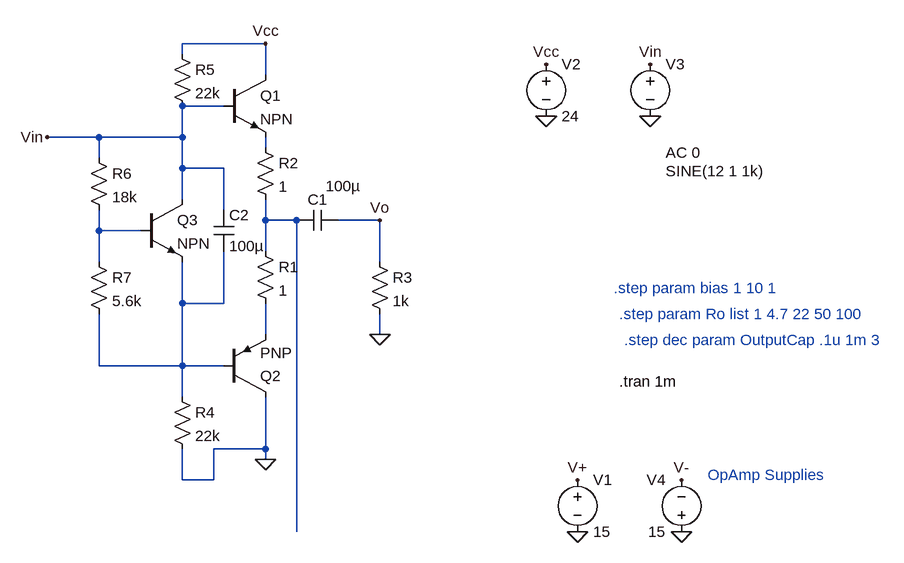
[diagram p0: schematic CompSym_OutputStage.asc]
CompSym_OutputStage.asc, the LTspice schematic file:
Version 4
SHEET 1 1480 720
WIRE 224 -80 96 -80
WIRE 96 -64 96 -80
WIRE 224 -32 224 -80
WIRE 160 16 96 16
WIRE -32 64 -112 64
WIRE 96 64 96 16
WIRE 96 64 -32 64
WIRE 224 80 224 64
WIRE -32 96 -32 64
WIRE 96 112 96 64
WIRE 160 112 96 112
WIRE 96 160 96 112
WIRE 160 176 160 112
WIRE 224 192 224 160
WIRE 272 192 224 192
WIRE 400 192 336 192
WIRE -32 208 -32 176
WIRE 32 208 -32 208
WIRE 224 240 224 192
WIRE -32 256 -32 208
WIRE 400 256 400 192
WIRE 96 320 96 256
WIRE 160 320 160 240
WIRE 160 320 96 320
WIRE 224 368 224 320
WIRE 400 368 400 336
WIRE -32 416 -32 336
WIRE 96 416 96 320
WIRE 96 416 -32 416
WIRE 160 416 96 416
WIRE 96 464 96 416
WIRE 224 544 224 464
WIRE 224 544 144 544
WIRE 224 560 224 544
WIRE 96 592 96 544
WIRE 144 592 144 544
WIRE 144 592 96 592
WIRE 272 672 272 192
FLAG 400 368 0
FLAG 224 -80 Vcc
FLAG 656 -48 Vcc
FLAG 656 32 0
FLAG 816 32 0
FLAG 816 -48 Vin
FLAG -112 64 Vin
FLAG 400 192 Vo
FLAG 224 560 0
FLAG 864 672 0
FLAG 704 672 0
FLAG 704 592 V+
FLAG 864 592 V-
SYMBOL res 208 224 R0
SYMATTR InstName R1
SYMATTR Value 1
SYMBOL cap 272 208 R270
WINDOW 0 32 32 VTop 2
WINDOW 3 84 72 VBottom 2
SYMATTR InstName C1
SYMATTR Value 100µ
SYMBOL res 208 64 R0
SYMATTR InstName R2
SYMATTR Value 1
SYMBOL res 384 240 R0
SYMATTR InstName R3
SYMATTR Value 1k
SYMBOL voltage 656 -64 R0
WINDOW 123 0 0 Left 2
WINDOW 39 0 0 Left 2
SYMATTR InstName V2
SYMATTR Value 24
SYMBOL voltage 816 -64 R0
WINDOW 3 24 180 Left 2
WINDOW 123 24 152 Left 2
WINDOW 39 24 124 Left 2
SYMATTR Value SINE(12 1 1k)
SYMATTR Value2 AC 0
SYMATTR InstName V3
SYMBOL npn 32 160 R0
SYMATTR InstName Q3
SYMBOL res -48 80 R0
SYMATTR InstName R6
SYMATTR Value 18k
SYMBOL res -48 240 R0
SYMATTR InstName R7
SYMATTR Value 5.6k
SYMBOL res 80 448 R0
SYMATTR InstName R4
SYMATTR Value 22k
SYMBOL res 80 -80 R0
SYMATTR InstName R5
SYMATTR Value 22k
SYMBOL cap 144 176 R0
SYMATTR InstName C2
SYMATTR Value 100µ
SYMBOL npn 160 -32 R0
SYMATTR InstName Q1
SYMBOL pnp 160 464 M180
SYMATTR InstName Q2
SYMBOL voltage 704 576 R0
WINDOW 123 0 0 Left 2
WINDOW 39 0 0 Left 2
SYMATTR InstName V1
SYMATTR Value 15
SYMBOL voltage 864 688 R180
WINDOW 0 24 96 Left 2
WINDOW 3 24 16 Left 2
WINDOW 123 0 0 Left 2
WINDOW 39 0 0 Left 2
SYMATTR InstName V4
SYMATTR Value 15
TEXT 768 440 Left 2 !.tran 1m
TEXT 760 296 Left 2 ;.step param bias 1 10 1
TEXT 768 336 Left 2 ;.step param Ro list 1 4.7 22 50 100
TEXT 776 376 Left 2 ;.step dec param OutputCap .1u 1m 3
TEXT 904 584 Left 2 ;OpAmp Supplies

The netlist it stands for:
* CompSym_OutputStage.asc
R1 N002 N005 1
C1 N002 Vo 100µ
R2 N001 N002 1
R3 Vo 0 1k
V2 Vcc 0 24
V3 Vin 0 SINE(12 1 1k) AC 0
Q3 Vin N003 N004 0 NPN
R6 Vin N003 18k
R7 N003 N004 5.6k
R4 N004 0 22k
R5 Vcc Vin 22k
C2 Vin N004 100µ
Q1 Vcc Vin N001 0 NPN
Q2 0 N004 N005 0 PNP
V1 V+ 0 15
V4 0 V- 15
.model NPN NPN
.model PNP PNP
.lib standard.bjt
.tran 1m
* .step param bias 1 10 1
* .step param Ro list 1 4.7 22 50 100
* .step dec param OutputCap .1u 1m 3
* OpAmp Supplies
.backanno
.end